# EAGLE schematic module (EAGLE 9.0.1)
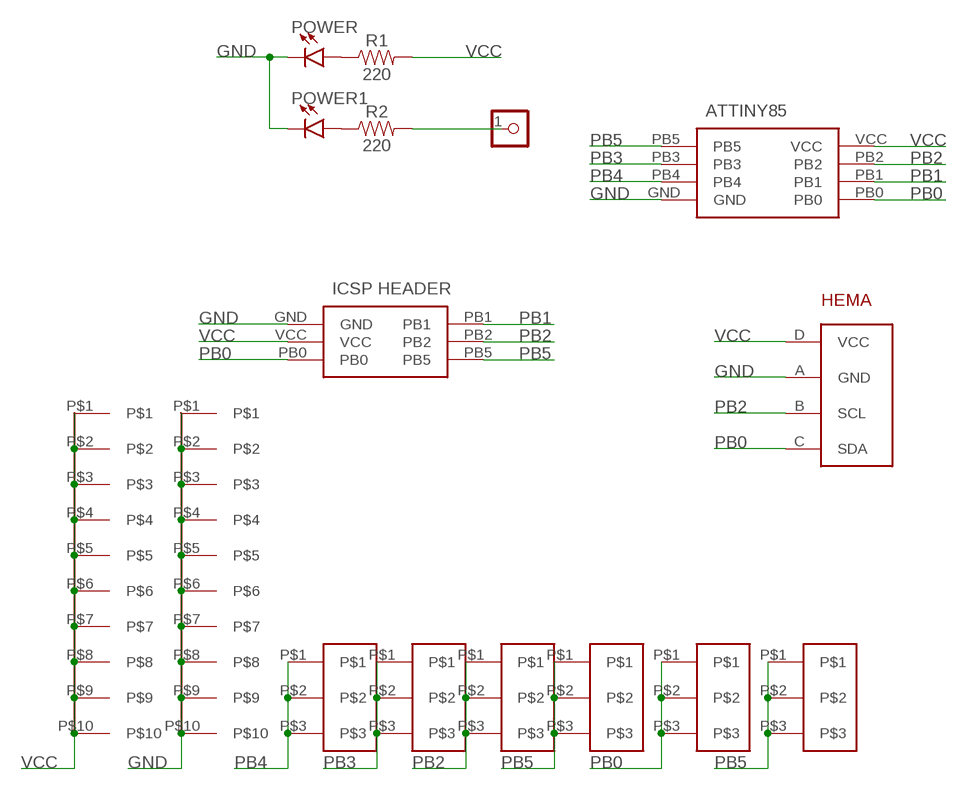
[diagram p0: schematic, sheet 1]

## Parts
0  3X-PADS-CONNECTED  [3X-PADS]
1  3X-PADS-CONNECTED  [3X-PADS]
2  3X-PADS-CONNECTED  [3X-PADS]
3  3X-PADS-CONNECTED  [3X-PADS]
4  3X-PADS-CONNECTED  [3X-PADS]
5  3X-PADS-CONNECTED  [3X-PADS]
GND  10X-PADS  [10X-PADS]
IC1  ATTINY85-20SU  [SOT127P798X216-8N]
J1  M20-9980346  [HDRV6W64P254_2X3_762X508X868P]
P1  PROTO_VIAS_01X01-1.2  [PROTO_VIAS_01X01_1.2]
POWER  LED3MM  [LED_3MM]
POWER1  LED3MM  [LED_3MM]
R1  220  RESISTORAXIAL-0.3  [AXIAL-0.3]
R2  220  RESISTORAXIAL-0.3  [AXIAL-0.3]
U$1  HEMA-I2C  [HEMA-I2C]
VCC  10X-PADS  [10X-PADS]

## Nets
GND [GND]: GND.P$1 GND.P$2 GND.P$3 GND.P$4 GND.P$5 GND.P$6 GND.P$7 GND.P$8 GND.P$9 GND.P$10 IC1.GND J1.GND POWER1.K(C) POWER.K(C) U$1.A(GND)
N$1: POWER1.A R2.P$1
N$2: P1.1 R2.P$2
N$11: POWER.A R1.P$1
PB0: 0.P$1 0.P$2 0.P$3 IC1.PB0 J1.PB0 U$1.C(SDA)
PB1: IC1.PB1 J1.PB1
PB2: 2.P$1 2.P$2 2.P$3 IC1.PB2 J1.PB2 U$1.B(SCL)
PB3: 3.P$1 3.P$2 3.P$3 IC1.PB3
PB4: 4.P$1 4.P$2 4.P$3 IC1.PB4
PB5: 1.P$1 1.P$2 1.P$3 5.P$1 5.P$2 5.P$3 IC1.PB5 J1.PB5
VCC [VCC]: IC1.VCC J1.VCC R1.P$2 U$1.D(VCC) VCC.P$1 VCC.P$2 VCC.P$3 VCC.P$4 VCC.P$5 VCC.P$6 VCC.P$7 VCC.P$8 VCC.P$9 VCC.P$10

## Library data of the parts
0 1-5 = BadgeParts:3X-PADS-CONNECTED
GND VCC = BadgeParts:10X-PADS
IC1 = BadgeParts:ATTINY85-20SU: MICROCHIP - ATTINY85-20SU - MICROCONTROLLER MCU, 8 BIT, ATTINY, 20MHZ, SOIC-8 Source: Datasheet <https://componentsearchengine.com/Datasheets/2/ATTINY85-20SU.pdf>; ARROW_PART_NUMBER: ATTINY85-20SU; ARROW_PRICE/STOCK: https://www.arrow.com/en/products/attiny85-20su/microchip-technology; DESCRIPTION: MICROCHIP - ATTINY85-20SU - MICROCONTROLLER MCU, 8 BIT, ATTINY, 20MHZ, SOIC-8; HEIGHT: 2.16mm; MANUFACTURER_NAME: Microchip; MANUFACTURER_PART_NUMBER: ATTINY85-20SU; RS_PART_NUMBER: 1331674; RS_PRICE/STOCK: http://uk.rs-online.com/web/p/products/1331674
J1 = BadgeParts:M20-9980346: 03+03 DIL Vertical Pin Header HARWIN M20 Series, 2.54mm Pitch 6 Way 2 Row Straight PCB Header, Solder Termination, 3A Source: Datasheet <https://cdn.harwin.com/pdfs/M20-998.pdf?utm_source=3D_PDF&utm_medium=3D_PDF&utm_campaign=3D_PDF>; ARROW_PART_NUMBER: M20-9980346; ARROW_PRICE/STOCK: http://uk.rs-online.com/web/p/products/7457046P; DESCRIPTION: 03+03 DIL Vertical Pin Header HARWIN M20 Series, 2.54mm Pitch 6 Way 2 Row Straight PCB Header, Solder Termination, 3A; HEIGHT: 8.68mm; MANUFACTURER_NAME: HARWIN; MANUFACTURER_PART_NUMBER: M20-9980346; RS_PART_NUMBER: 7457046P; RS_PRICE/STOCK: http://uk.rs-online.com/web/p/products/7457046P
P1 = dp_devices:PROTO_VIAS_01X01: Single Pad for Protoboard Filling
POWER POWER1 = SparkFun-LED:LED: LED (Generic) Standard schematic elements and footprints for 5mm, 3mm, 1206, and 0603 sized LEDs. Generic LEDs with no color specified.; PROD_ID: DIO-08794
R1 R2 = SparkFun-Resistors:RESISTOR: Generic Resistor Package
U$1 = BadgeParts:HEMA-I2C

## Net classes
0 default: width 0.254 mm, clearance 0.381 mm
1 VCC: width 0.635 mm, clearance 0.381 mm
2 GND: width 0.635 mm, clearance 0.381 mm